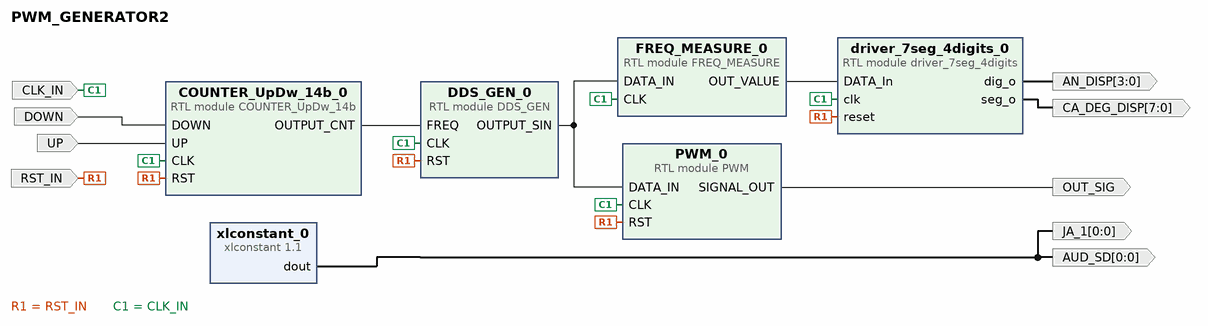
[diagram p0: block diagram of the top level]
# Vivado block design PWM_GENERATOR2, xc7a50ticsg324-1L, Vivado 2021.2
create_bd_design PWM_GENERATOR2

create_bd_port -dir O OUT_SIG
create_bd_port -dir I UP
create_bd_port -dir I DOWN
create_bd_port -dir I RST_IN
create_bd_port -dir I CLK_IN
create_bd_port -dir O -from 7 -to 0 CA_DEG_DISP
create_bd_port -dir O -from 3 -to 0 AN_DISP
create_bd_port -dir O -from 0 -to 0 JA_1
create_bd_port -dir O -from 0 -to 0 AUD_SD

create_bd_cell -type module -reference COUNTER_UpDw_14b COUNTER_UpDw_14b_0
create_bd_cell -type module -reference DDS_GEN DDS_GEN_0
create_bd_cell -type module -reference FREQ_MEASURE FREQ_MEASURE_0
create_bd_cell -type module -reference PWM PWM_0
create_bd_cell -type module -reference driver_7seg_4digits driver_7seg_4digits_0
create_bd_cell -type ip -vlnv xilinx.com:ip:xlconstant:1.1 xlconstant_0

# ---- connections ----

connect_bd_net -net COUNTER_UpDw_14b_0_OUTPUT [get_bd_pins COUNTER_UpDw_14b_0/OUTPUT_CNT] [get_bd_pins DDS_GEN_0/FREQ]
connect_bd_net -net DDS_GEN_0_OUTPUT [get_bd_pins DDS_GEN_0/OUTPUT_SIN] [get_bd_pins FREQ_MEASURE_0/DATA_IN] [get_bd_pins PWM_0/DATA_IN]
connect_bd_net [get_bd_ports DOWN] [get_bd_pins COUNTER_UpDw_14b_0/DOWN]
connect_bd_net [get_bd_pins FREQ_MEASURE_0/OUT_VALUE] [get_bd_pins driver_7seg_4digits_0/DATA_In]
connect_bd_net [get_bd_ports RST_IN] \
  [get_bd_pins COUNTER_UpDw_14b_0/RST] [get_bd_pins DDS_GEN_0/RST] [get_bd_pins PWM_0/RST] \
  [get_bd_pins driver_7seg_4digits_0/reset]
connect_bd_net [get_bd_ports CLK_IN] \
  [get_bd_pins COUNTER_UpDw_14b_0/CLK] [get_bd_pins DDS_GEN_0/CLK] [get_bd_pins FREQ_MEASURE_0/CLK] [get_bd_pins PWM_0/CLK] \
  [get_bd_pins driver_7seg_4digits_0/clk]
connect_bd_net [get_bd_pins PWM_0/SIGNAL_OUT] [get_bd_ports OUT_SIG]
connect_bd_net [get_bd_ports UP] [get_bd_pins COUNTER_UpDw_14b_0/UP]
connect_bd_net [get_bd_pins driver_7seg_4digits_0/dig_o] [get_bd_ports AN_DISP]
connect_bd_net [get_bd_pins driver_7seg_4digits_0/seg_o] [get_bd_ports CA_DEG_DISP]
connect_bd_net [get_bd_pins xlconstant_0/dout] [get_bd_ports JA_1] [get_bd_ports AUD_SD]

validate_bd_design
save_bd_design
